# EAGLE schematic Senior_Design_2 (EAGLE 9.6.0)
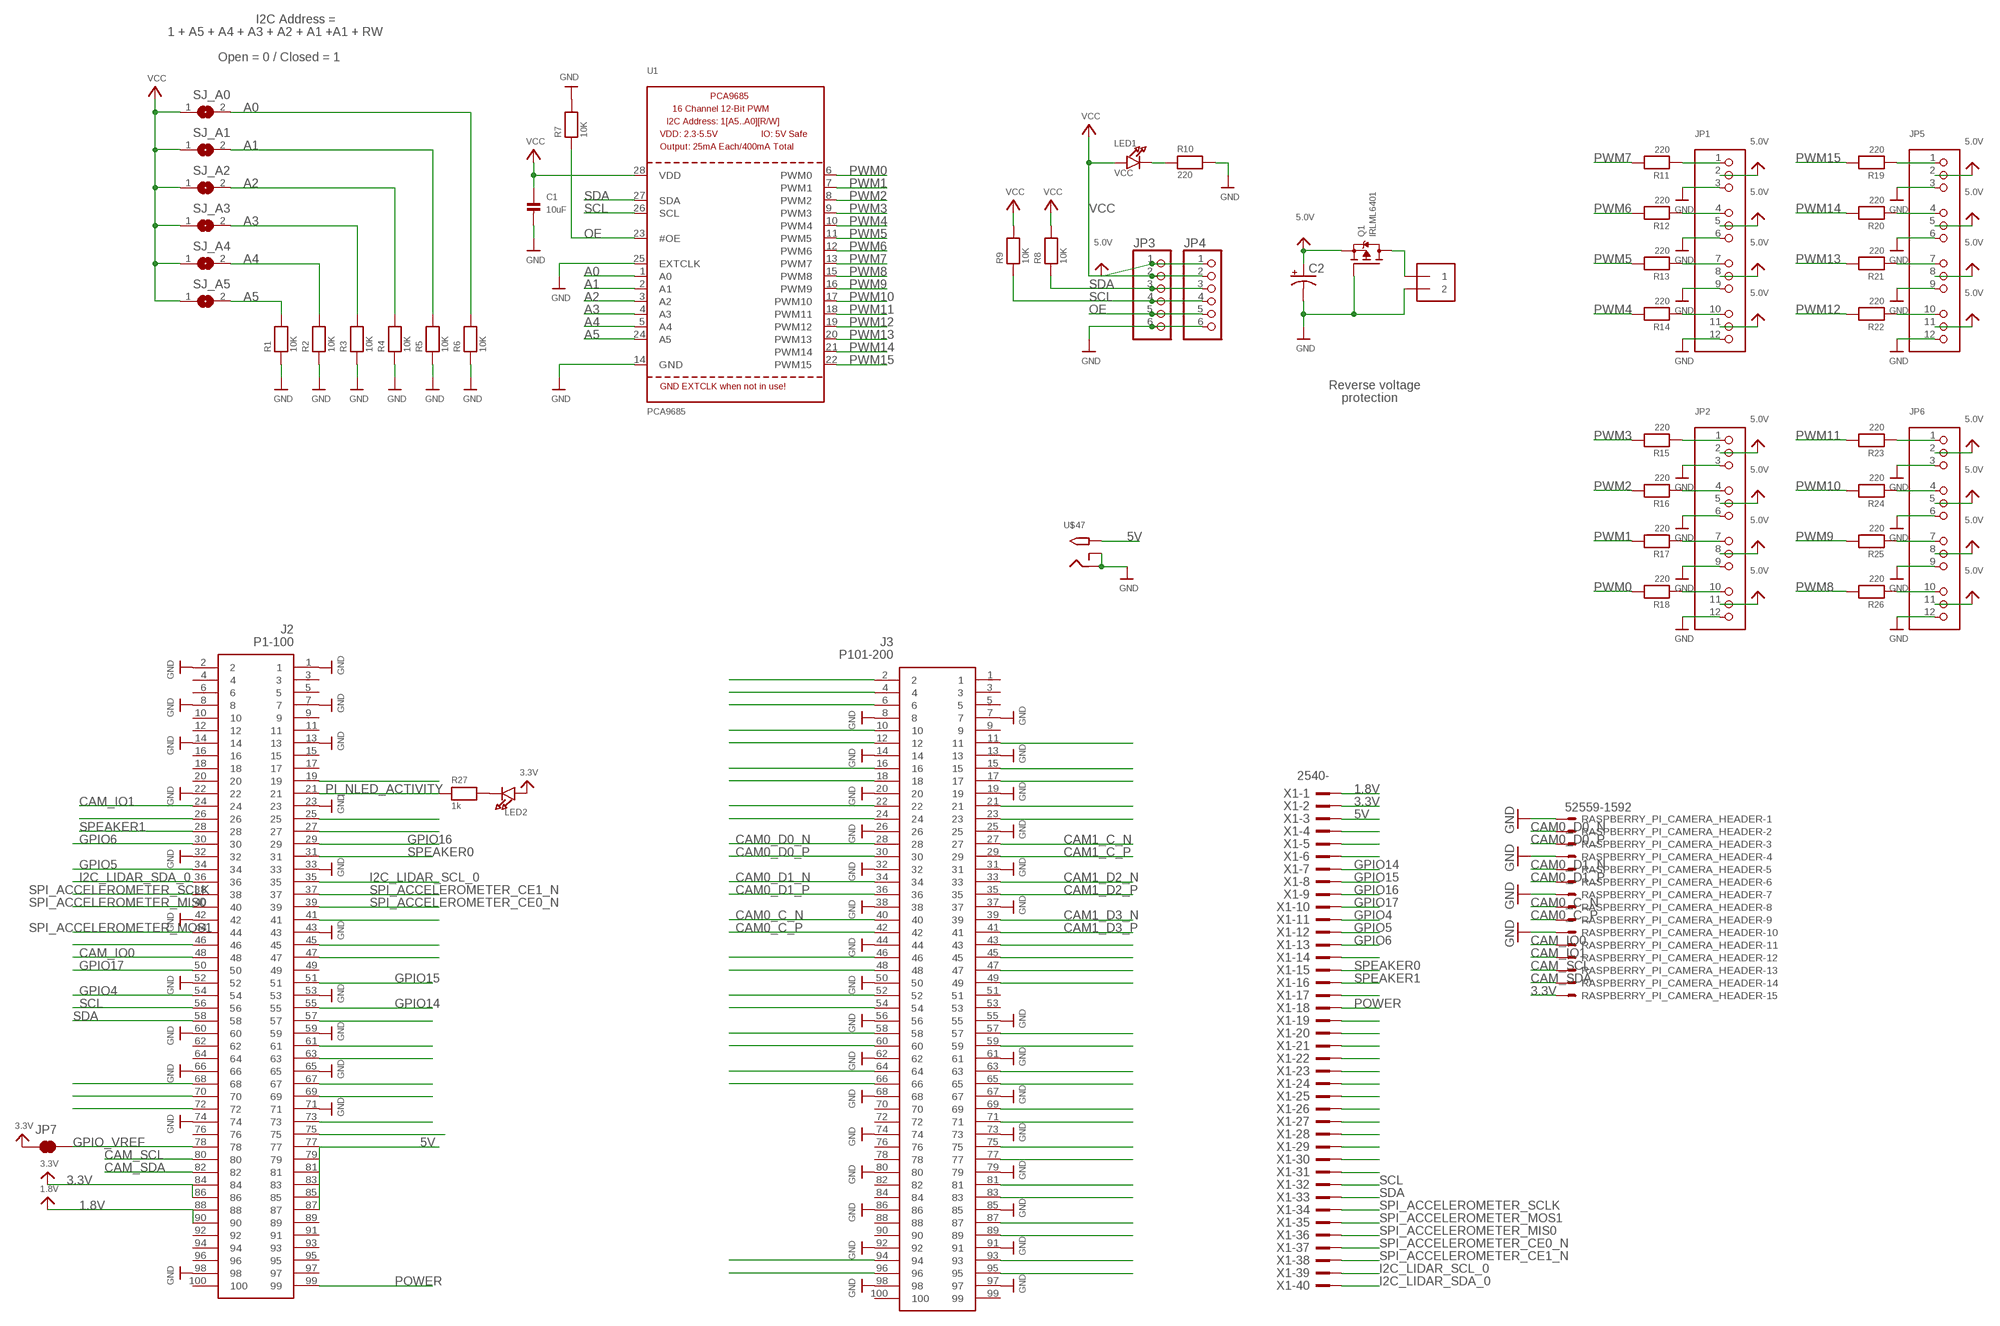
[diagram p0: schematic, sheet 1]

## Parts
C1  10uF  CAP_CERAMIC0805  [0805@1]
C2  CPOL-USE3.5-8  [E3,5-8]
J1  TERMBLOCK_1X2-3.5MM  [1X2-3.5MM]
J2  P1-100  DF40C-100DS-0.4V_51_  [DF40C100DS04V51]
J3  P101-200  DF40C-100DS-0.4V_51_  [DF40C100DS04V51]
JP1  HEADER-3X04  [3X04]
JP2  HEADER-3X04  [3X04]
JP3  PINHD-1X6CB  [1X06-CLEANBIG]
JP4  PINHD-1X6CB  [1X06-CLEANBIG]
JP5  HEADER-3X04  [3X04]
JP6  HEADER-3X04  [3X04]
JP7  JUMPER-SMT_2_NC_TRACE_NO-SILK  [SMT-JUMPER_2_NC_TRACE_NO-SILK]
LED1  VCC  LED0805  [CHIPLED_0805]
LED2  LED0603  [CHIPLED_0603]
Q1  IRLML6401  MOSFET-PWIDE  [SOT23-WIDE]
R1  10K  RESISTOR0805  [0805]
R2  10K  RESISTOR0805  [0805]
R3  10K  RESISTOR0805  [0805]
R4  10K  RESISTOR0805  [0805]
R5  10K  RESISTOR0805  [0805]
R6  10K  RESISTOR0805  [0805]
R7  10K  RESISTOR0805  [0805]
R8  10K  RESISTOR0805  [0805]
R9  10K  RESISTOR0805  [0805]
R10  220  RESISTOR0805  [0805]
R11  220  RESISTOR0805  [0805]
R12  220  RESISTOR0805  [0805]
R13  220  RESISTOR0805  [0805]
R14  220  RESISTOR0805  [0805]
R15  220  RESISTOR0805  [0805]
R16  220  RESISTOR0805  [0805]
R17  220  RESISTOR0805  [0805]
R18  220  RESISTOR0805  [0805]
R19  220  RESISTOR0805  [0805]
R20  220  RESISTOR0805  [0805]
R21  220  RESISTOR0805  [0805]
R22  220  RESISTOR0805  [0805]
R23  220  RESISTOR0805  [0805]
R24  220  RESISTOR0805  [0805]
R25  220  RESISTOR0805  [0805]
R26  220  RESISTOR0805  [0805]
R27  1k  RESISTOR_0402MP  [_0402MP]
RASPBERRY_PI_CAMERA_HEADER  52559-1592  [52559-1592]
SJ_A0  SOLDERJUMPERREFLOW_NOPASTE  [SOLDERJUMPER_REFLOW_NOPASTE]
SJ_A1  SOLDERJUMPERREFLOW_NOPASTE  [SOLDERJUMPER_REFLOW_NOPASTE]
SJ_A2  SOLDERJUMPERREFLOW_NOPASTE  [SOLDERJUMPER_REFLOW_NOPASTE]
SJ_A3  SOLDERJUMPERREFLOW_NOPASTE  [SOLDERJUMPER_REFLOW_NOPASTE]
SJ_A4  SOLDERJUMPERREFLOW_NOPASTE  [SOLDERJUMPER_REFLOW_NOPASTE]
SJ_A5  SOLDERJUMPERREFLOW_NOPASTE  [SOLDERJUMPER_REFLOW_NOPASTE]
U1  PCA9685  [TSSOP28]
U$47  2.1MMJACKTHM  [PJ-102A]
X1  2540-  [PAK100/2500-40]

## Nets
1.8V: J2.88 J2.90 X1.1
3.3V: J2.84 J2.86 JP7.1 LED2.A RASPBERRY_PI_CAMERA_HEADER.15 X1.2
5.0V: C2.+ JP1.2 JP1.5 JP1.8 JP1.11 JP2.2 JP2.5 JP2.8 JP2.11 JP3.1 JP4.1 JP5.2 JP5.5 JP5.8 JP5.11 JP6.2 JP6.5 JP6.8 JP6.11 Q1.2(S)
5V: J2.77 J2.79 J2.81 J2.83 J2.85 J2.87 U$47.TIP X1.3
A0: R6.2 SJ_A0.2 U1.1(A0)
A1: R5.2 SJ_A1.2 U1.2(A1)
A2: R4.2 SJ_A2.2 U1.3(A2)
A3: R3.2 SJ_A3.2 U1.4(A3)
A4: R2.2 SJ_A4.2 U1.5(A4)
A5: R1.2 SJ_A5.2 U1.24(A5)
CAM0_C_N: J3.40 RASPBERRY_PI_CAMERA_HEADER.8
CAM0_C_P: J3.42 RASPBERRY_PI_CAMERA_HEADER.9
CAM0_D0_N: J3.28 RASPBERRY_PI_CAMERA_HEADER.2
CAM0_D0_P: J3.30 RASPBERRY_PI_CAMERA_HEADER.3
CAM0_D1_N: J3.34 RASPBERRY_PI_CAMERA_HEADER.5
CAM0_D1_P: J3.36 RASPBERRY_PI_CAMERA_HEADER.6
CAM1_C_N: J3.27
CAM1_C_P: J3.29
CAM1_D2_N: J3.33
CAM1_D2_P: J3.35
CAM1_D3_N: J3.39
CAM1_D3_P: J3.41
CAM_IO0 [CAMIO]: J2.48 RASPBERRY_PI_CAMERA_HEADER.11
CAM_IO1 [CAMIO]: J2.24 RASPBERRY_PI_CAMERA_HEADER.12
CAM_SCL: J2.80 RASPBERRY_PI_CAMERA_HEADER.13
CAM_SDA: J2.82 RASPBERRY_PI_CAMERA_HEADER.14
GND: C1.2 C2.- J1.2 J2.1 J2.2 J2.7 J2.8 J2.13 J2.14 J2.22 J2.23 J2.32 J2.33 J2.42 J2.43 J2.52 J2.53 J2.59 J2.60 J2.65 J2.66 J2.71 J2.74 J2.98 J3.7 J3.8 J3.13 J3.14 J3.19 J3.20 J3.25 J3.26 J3.31 J3.32 J3.37 J3.38 J3.44 J3.50 J3.55 J3.56 J3.61 J3.62 J3.67 J3.68 J3.73 J3.74 J3.79 J3.80 J3.85 J3.86 J3.91 J3.92 J3.97 J3.98 JP1.3 JP1.6 JP1.9 JP1.12 JP2.3 JP2.6 JP2.9 JP2.12 JP3.6 JP4.6 JP5.3 JP5.6 JP5.9 JP5.12 JP6.3 JP6.6 JP6.9 JP6.12 Q1.1(G) R1.1 R2.1 R3.1 R4.1 R5.1 R6.1 R7.2 R10.2 RASPBERRY_PI_CAMERA_HEADER.1 RASPBERRY_PI_CAMERA_HEADER.4 RASPBERRY_PI_CAMERA_HEADER.7 RASPBERRY_PI_CAMERA_HEADER.10 U1.14(GND) U1.25(EXTCLK) U$47.RING U$47.RING_SW
GPIO4: J2.54 X1.11
GPIO5: J2.34 X1.12
GPIO6: J2.30 X1.13
GPIO14: J2.55 X1.7
GPIO15: J2.51 X1.8
GPIO16: J2.29 X1.9
GPIO17: J2.50 X1.10
GPIO_VREF: J2.78 JP7.2
I2C_LIDAR_SCL_0: J2.35 X1.39
I2C_LIDAR_SDA_0: J2.36 X1.40
N$1: LED1.C R10.1
N$2: JP1.4 R12.1
N$3: JP1.1 R11.1
N$4: JP1.7 R13.1
N$5: JP1.10 R14.1
N$6: JP2.1 R15.1
N$7: JP2.4 R16.1
N$8: JP2.7 R17.1
N$9: JP2.10 R18.1
N$10: JP6.10 R26.1
N$11: JP6.7 R25.1
N$12: JP6.4 R24.1
N$13: JP6.1 R23.1
N$14: JP5.10 R22.1
N$15: JP5.7 R21.1
N$16: JP5.4 R20.1
N$17: JP5.1 R19.1
N$18: LED2.C R27.2
N$19: J2.19
N$20: J3.2
N$21: J3.4
N$22: J3.6
N$24: J3.10
N$25: J2.25
N$26: J3.11
N$27: J2.27
N$28: J3.12
N$29: X1.4
N$30: X1.5
N$31: J3.15
N$32: J3.16
N$33: J3.17
N$35: J3.18
N$36: J3.21
N$37: J3.22
N$41: J2.41
N$42: J3.23
N$43: J3.24
N$45: J2.45
N$46: J2.46
N$47: J2.47
N$53: X1.14
N$56: J2.57
N$60: X1.17
N$62: X1.19
N$64: X1.20
N$65: X1.21
N$67: X1.22
N$68: J2.68
N$69: X1.23
N$70: J2.70
N$71: X1.24
N$72: J2.72
N$75: X1.25
N$77: X1.26
N$78: J3.43
N$79: X1.27
N$80: X1.28
N$81: J3.45
N$83: J3.46
N$84: J3.47
N$85: J3.48
N$86: J3.49
N$87: X1.29
N$88: X1.30
N$90: J3.52
N$92: X1.31
N$93: J3.54
N$96: X1.6
N$99: J3.57
N$100: J3.58
N$101: J3.59
N$102: J3.60
N$105: J3.63
N$106: J3.64
N$107: J3.65
N$108: J3.66
N$110: J2.75
N$111: J3.69
N$112: J2.73
N$113: J3.71
N$114: J2.67
N$115: J2.69
N$116: J2.63
N$117: J3.75
N$118: J2.61
N$119: J3.77
N$121: J2.26
N$123: J3.81
N$125: J3.83
N$129: J3.87
N$131: J3.89
N$135: J3.93
N$136: J3.94
N$137: J3.95
N$138: J3.96
OE: JP3.5 JP4.5 R7.1 U1.23(#OE)
PI_NLED_ACTIVITY: J2.21 R27.1
POWER: J2.99 X1.18
PWM0: R18.2 U1.6(PWM0)
PWM1: R17.2 U1.7(PWM1)
PWM2: R16.2 U1.8(PWM2)
PWM3: R15.2 U1.9(PWM3)
PWM4: R14.2 U1.10(PWM4)
PWM5: R13.2 U1.11(PWM5)
PWM6: R12.2 U1.12(PWM6)
PWM7: R11.2 U1.13(PWM7)
PWM8: R26.2 U1.15(PWM8)
PWM9: R25.2 U1.16(PWM9)
PWM10: R24.2 U1.17(PWM10)
PWM11: R23.2 U1.18(PWM11)
PWM12: R22.2 U1.19(PWM12)
PWM13: R21.2 U1.20(PWM13)
PWM14: R20.2 U1.21(PWM14)
PWM15: R19.2 U1.22(PWM15)
PWRIN: J1.1 Q1.3(D)
SCL: J2.56 JP3.4 JP4.4 R9.1 U1.26(SCL) X1.32
SDA: J2.58 JP3.3 JP4.3 R8.1 U1.27(SDA) X1.33
SPEAKER0: J2.31 X1.15
SPEAKER1: J2.28 X1.16
SPI_ACCELEROMETER_CE0_N: J2.39 X1.37
SPI_ACCELEROMETER_CE1_N: J2.37 X1.38
SPI_ACCELEROMETER_MIS0: J2.40 X1.36
SPI_ACCELEROMETER_MOS1: J2.44 X1.35
SPI_ACCELEROMETER_SCLK: J2.38 X1.34
VCC: C1.1 JP3.2 JP4.2 LED1.A R8.2 R9.2 SJ_A0.1 SJ_A1.1 SJ_A2.1 SJ_A3.1 SJ_A4.1 SJ_A5.1 U1.28(VDD)
Unconnected: J2.3 J2.4 J2.5 J2.6 J2.9 J2.10 J2.11 J2.12 J2.15 J2.16 J2.17 J2.18 J2.20 J2.49 J2.62 J2.64 J2.76 J2.89 J2.91 J2.92 J2.93 J2.94 J2.95 J2.96 J2.97 J2.100 J3.1 J3.3 J3.5 J3.9 J3.51 J3.53 J3.70 J3.72 J3.76 J3.78 J3.82 J3.84 J3.88 J3.90 J3.99 J3.100

## Notes on the sheet
- I2C Address =
- 1 + A5 + A4 + A3 + A2 + A1 +A1 + RW
- Open = 0 / Closed = 1
- Reverse voltage
- protection

## Library data of the parts
C1 = microbuilder:CAP_CERAMIC: Ceramic Capacitors 0402 - 0402 Surface Mount Capacitors 16pF 50V 5% [Digikey: 445-4899-2-ND] 18pF 50V 5% [Digikey: 490-1281-2-ND] 22pF 50V 5% [Digikey: 490-1283-2-ND] 68pF 50V 5% [Digikey: 490-1289-2-ND] 0.1uF 10V 10% [Digikey: 490-1318-2-ND] 1.0uF 6.3V 10% [Digikey: 490-1320-2-ND] 0603 - 0603 Surface Mount Capacitors 16 pF 50V 5% [Digikey: 445-5051-2-ND] 22 pF 50V [Digikey: PCC220ACVTR-ND] 33 pF 50V 5% [Digikey: 490-1415-1-ND] 56pF 50V 5% [Digikey: 490-1421-1-ND] 220pF 50V 5% [Digikey: 445-1285-1-ND] 680 pF 50V 2200 pF 50V 5% C0G [Digikey: 445-1297-1-ND] 5600 pF 100V 5% X7R [Digikey: 478-3711-1-ND] 0.1 µF 25V 10% [Digikey: PCC2277TR-ND] 0.22 µF 16V 10% X7R [Digikey: 445-1318-1-ND] 1.0 µF 25V 10% [Digikey: 445-5146-2-ND] 0603 - RF Specific 3pF 250V +/-0.1pF RF [Digikey: 712-1347-1-ND] 18 pF 250V 5% [Digikey: 478-3505-1-ND or 712-1322-1-ND] 56 pF 250V 5% C0G RF [Digikey: 490-4867-1-ND] 68 pF 250V RF [Digikey: 490-4868-1-ND] 0805 - 0805 Surface Mount Capacitors 220 pF 250V 2% RF Ceramic Capacitor [Digikey: 712-1398-1-ND] 1000 pF 50V 2% NP0 Ceramic Capacitor [Digikey: 478-3760-1-ND] 0.1 µF 25V 10% Ceramic Capacitor [Digikey: PCC1828TR-ND] 1.0 µF 16V 10% Ceramic Capacitor[Digikey: 490-1691-2-ND] 10.0 µF 10V 10% Ceramic Capacitor[Digikey: 709-1228-1-ND] 10.0 uF 16V 10% Ceramic Capacitor [Digikey: 478-5165-2-ND] 47 uF 6.3V 20% Ceramic Capacitor [Digikey: 587-1779-1-ND or 399-5506-1-ND] 1206 - 1206 Surface Mount Capacitors 47uF 10V 20% Ceramic Capacitor [Digikey: 490-5528-1-ND or 399-5508-1-ND or 445-6010-1-ND] 100uF 6.3V -20%, +80% Y5V Ceramic Capacitor (Digikey: 490-4512-1-ND, Mouser: 81-GRM31CF50J107ZE1L)
C2 = adafruit:CPOL-US: POLARIZED CAPACITOR, American symbol
J1 = microbuilder:TERMBLOCK_1X2: 3.5mm Terminal block http://www.ladyada.net/library/pcb/eaglelibrary.html
J2 = SamacSys_Parts:DF40C-100DS-0.4V_51_: HIROSE(HRS) - DF40C-100DS-0.4V(51) - CONNECTOR, STACKING, RCPT, 100POS, 2ROW Source: Datasheet <https://www.hirose.com/product/en/download_file/key_name/DF40C-100DS-0.4V(51)/category/Drawing (2D)/doc_file_id/46856/?file_category_id=6&item_id=06844033451&is_series=>; DESCRIPTION: HIROSE(HRS) - DF40C-100DS-0.4V(51) - CONNECTOR, STACKING, RCPT, 100POS, 2ROW; HEIGHT: 1.65mm; MANUFACTURER_NAME: Hirose; MANUFACTURER_PART_NUMBER: DF40C-100DS-0.4V(51); MF: VISHAY; MOUSER_PART_NUMBER: 798-DF40C100DS0.4V51; MOUSER_PRICE-STOCK: https://www.mouser.co.uk/ProductDetail/Hirose-Connector/DF40C-100DS-04V51?qs=eDUdFcBPps2MEwbnuPvZzQ%3D%3D; MPN: MCW0406MD1003BP100; OC_NEWARK: 31W9017
J3 = SamacSys_Parts:DF40C-100DS-0.4V_51_: HIROSE(HRS) - DF40C-100DS-0.4V(51) - CONNECTOR, STACKING, RCPT, 100POS, 2ROW Source: Datasheet <https://www.hirose.com/product/en/download_file/key_name/DF40C-100DS-0.4V(51)/category/Drawing (2D)/doc_file_id/46856/?file_category_id=6&item_id=06844033451&is_series=>; DESCRIPTION: HIROSE(HRS) - DF40C-100DS-0.4V(51) - CONNECTOR, STACKING, RCPT, 100POS, 2ROW; HEIGHT: 1.65mm; MANUFACTURER_NAME: Hirose; MANUFACTURER_PART_NUMBER: DF40C-100DS-0.4V(51); MOUSER_PART_NUMBER: 798-DF40C100DS0.4V51; MOUSER_PRICE-STOCK: https://www.mouser.co.uk/ProductDetail/Hirose-Connector/DF40C-100DS-04V51?qs=eDUdFcBPps2MEwbnuPvZzQ%3D%3D; OC_NEWARK: unknown
JP1 JP2 JP5 JP6 = microbuilder:HEADER-3X04
JP3 JP4 = adafruit:PINHD-1X6: PIN HEADER
JP7 = SparkFun-Jumpers:JUMPER-SMT_2_NC_TRACE: Normally closed trace jumper This jumper has a trace between two pads so it's normally closed (NC). Use a razor knife to open the connection. For best results follow the IPC guidelines for cutting traces: Cutout at least 0.063 mm (0.005 in). Remove all loose material to clean up the cut area. Seal the cut with an approved epoxy. Reapply solder to reclose the connection.; OC_NEWARK: unknown
LED1 = microbuilder:LED: LED 0603 - 0603 Surface Mount Package 2mA: Green LED - Low Power (3.9mcd, 2ma, 1.7Vf) - Digikey: 475-2709-2-ND Orange LED - Low Power (9.8mcd, 2ma, 1.8Vf) - Digikey: 475-1194-2-ND Red LED - Low Power (5mcd, 2ma, 1.8Vf) - Digikey: 475-1195-2-ND Yellow LED - Low Power (7mcd, 2ma, 1.8Vf) - Digikey: 475-1196-2-ND 5mA: Blue LED - Low Power (17mcd, 5ma, 2.9Vf) - Digikey: LNJ937W8CRACT-ND 0805 - 0805 Surface Mount Package 2mA: Red LED (8.8mcd, 2mA, 1.8Vf, Clear) - Low Power [Digikey: 475-2510-1-ND] Green LED (5mcd, 2mA, 1.8Vf, Clear) - Low Power [Digikey: 475-2730-1-ND] Yellow LED (11.3mcd, 2mA, 1.8Vf, Clear) - Low Power [Digikey: 475-2555-1-ND] 20mA: Red LED (104mcd, 20mA, Diffused) - LS R976 [Digikey: 475-1278-6-ND] Red LED (12mcd, 20mA, 2.0Vf, Clear) - APT2012EC [Digikey: 754-1128-1-ND] Green LED (15mcd, 20mA, 2.2Vf, Clear) - APT2012GC [Digikey: 754-1131-1-ND] Orange LED (160mcd, 20mA, 2.1Vf, Clear) - APT2012SECK [Digikey: 754-1130-1-ND] 1206 - 1206 Surface Mount Package Green LED (26mcd, 20mA, Diffused) - LG N971 [Digikey: 475-1407-6-ND] Red LED (15mcd, 20mA, Diffused) - LH N974 [Digikey: 475-1416-6-ND]
LED2 = microbuilder:LED: LED 0603 - 0603 Surface Mount Package 2mA: Green LED - Low Power (3.9mcd, 2ma, 1.7Vf) - Digikey: 475-2709-2-ND Orange LED - Low Power (9.8mcd, 2ma, 1.8Vf) - Digikey: 475-1194-2-ND Red LED - Low Power (5mcd, 2ma, 1.8Vf) - Digikey: 475-1195-2-ND Yellow LED - Low Power (7mcd, 2ma, 1.8Vf) - Digikey: 475-1196-2-ND 5mA: Blue LED - Low Power (17mcd, 5ma, 2.9Vf) - Digikey: LNJ937W8CRACT-ND 0805 - 0805 Surface Mount Package 2mA: Red LED (8.8mcd, 2mA, 1.8Vf, Clear) - Low Power [Digikey: 475-2510-1-ND] Green LED (5mcd, 2mA, 1.8Vf, Clear) - Low Power [Digikey: 475-2730-1-ND] Yellow LED (11.3mcd, 2mA, 1.8Vf, Clear) - Low Power [Digikey: 475-2555-1-ND] 20mA: Red LED (104mcd, 20mA, Diffused) - LS R976 [Digikey: 475-1278-6-ND] Red LED (12mcd, 20mA, 2.0Vf, Clear) - APT2012EC [Digikey: 754-1128-1-ND] Green LED (15mcd, 20mA, 2.2Vf, Clear) - APT2012GC [Digikey: 754-1131-1-ND] Orange LED (160mcd, 20mA, 2.1Vf, Clear) - APT2012SECK [Digikey: 754-1130-1-ND] 1206 - 1206 Surface Mount Package Green LED (26mcd, 20mA, Diffused) - LG N971 [Digikey: 475-1407-6-ND] Red LED (15mcd, 20mA, Diffused) - LH N974 [Digikey: 475-1416-6-ND]; MF: OSRAM; MPN: LS Q976-NR-1; OC_NEWARK: 32AC1319
Q1 = microbuilder:MOSFET-P: P-Channel Mosfet LEGEND VDS: Voltage Drain-Source ID: Drain Current RDS(ON): Drain-Source On-State Resistance VGS(TH): Gate-Source Threshold Voltage CISS: Drain-Source Input Capacitance SOT-23 Name VDS ID RDS(ON) VGS(TH) CISS Order Number IRLML5103 30V 760mA 600 mOhm -- 75pF @ 25V Digikey: IRLML5103PBFCT-ND NTR0202PL 20V 400mA 800 mOhm 2.3V @ 250uA 70pF @ 5V Digikey: NTR0202PLT1GOSTR-ND NTR4101PT1G 20V 1.8A 85 mOhm 1.2V @ 250uA 675pF @ 10V Digikey: NTR4101PT1GOSCT-ND DMP2004K 20V 600mA 900 mOhm 1V @ 250uA 175pF @ 16V Digikey: DMP2004KDICT-ND PMV65XP 20V 3.9A 76 mOhm 950mV @ 1mA 725pF @ 20V Digikey: 568-2358-2-ND TO-252 Name VDS ID RDS(ON) VGS(TH) CISS Order Number AOD417 30V 25A 34 mOhm 3V @ 250µA 920pF @ 15V Digikey: 785-1106-2-ND
R1-R26 = microbuilder:RESISTOR: Resistors For new designs, use the packages preceded by an '_' character since they are more reliable: The following footprints should be used on most boards: _0402 - Standard footprint for regular board layouts _0603 - Standard footprint for regular board layouts _0805 - Standard footprint for regular board layouts For extremely tight-pitch boards where space is at a premium, the following 'micro-pitch' footprints can be used (smaller pads, no silkscreen outline, etc.): _0402MP - Micro-pitch footprint for very dense/compact boards _0603MP - Micro-pitch footprint for very dense/compact boards _0805MP - Micro-pitch footprint for very dense/compact boards
R27 = microbuilder:RESISTOR: Resistors For new designs, use the packages preceded by an '_' character since they are more reliable: The following footprints should be used on most boards: _0402 - Standard footprint for regular board layouts _0603 - Standard footprint for regular board layouts _0805 - Standard footprint for regular board layouts For extremely tight-pitch boards where space is at a premium, the following 'micro-pitch' footprints can be used (smaller pads, no silkscreen outline, etc.): _0402MP - Micro-pitch footprint for very dense/compact boards _0603MP - Micro-pitch footprint for very dense/compact boards _0805MP - Micro-pitch footprint for very dense/compact boards; MF: PANASONIC; MPN: ERJ-8ENF1001V; OC_NEWARK: 64R5430
RASPBERRY_PI_CAMERA_HEADER = con-molex:52559-1592: FFC/FPC-to-Board 0.50mm (.020") SMT, Vertical, ZIF Receptacle Source: http://www.molex.com/product/ffc/52559.html; OC_FARNELL: unknown; OC_NEWARK: unknown
SJ_A0 SJ_A1-SJ_A5 = microbuilder:SOLDERJUMPER: SMD Solder JUMPER Solder the two pads together to create a connection, or remove the solder to break it. REFLOW - Use this footprint for solder paste and reflow ovens. WAVE - Use this footprint for hand-soldering (larger pads). CLOSED - Has a trace between the two pads to ensure it is closed by default. The trace needs to be cut to disable the jumper, and can be closed again by creating a solder bridge between the two pads.
U1 = microbuilder:PCA9685: PCA9685 - 16 Channel 12-Bit I2C PWM Controller 5.0V tolerant 16 channel, 12-bit I2C PWM controller with 25mA per output (max. 400mA total) Digikey: 568-5931-1-ND
U$47 = adafruit:2.1MMJACK: 2.1mm x 5.5mm THM DC jack with internal switch. Digikey part #PJ-102A, 4UCON part #05537 2.1mm x 5.5mm SMT DC jack with internal switch. Digikey part #PJ-002A-SMT, 4UCON part #03267 By microbuilder.eu & adafruit.com
X1 = con-3m:2540-: 3M (TM) Pak 100 4-Wall Header Source: 3M; OC_FARNELL: unknown; OC_NEWARK: unknown